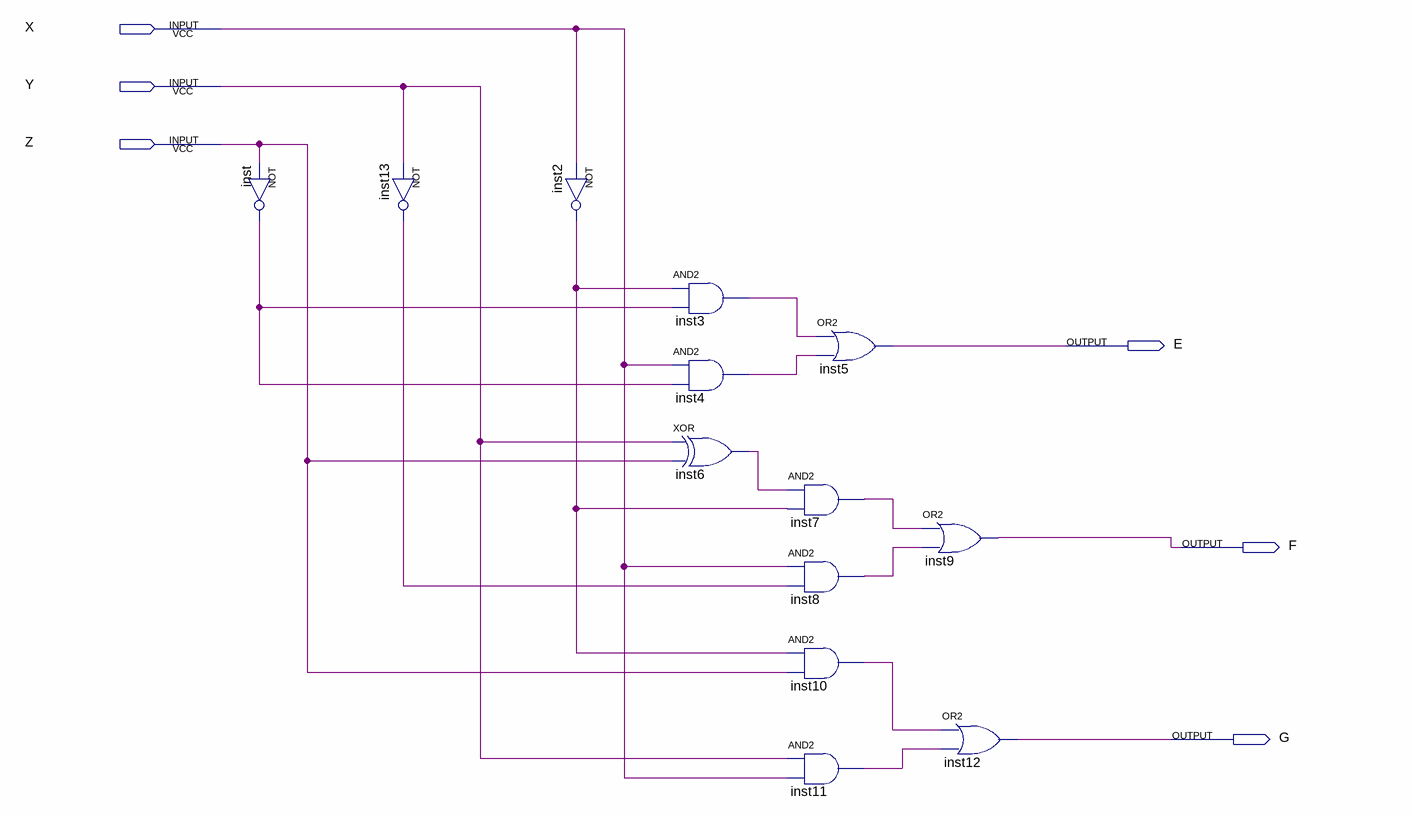
[diagram p0: schematic sheet]
// Quartus schematic lab2.bdf as structural Verilog: 13 symbols, 6 pins
module lab2 (
  input  X,
  input  Y,
  input  Z,
  output E,
  output F,
  output G
);

  wire inst2_out, inst3_out, inst4_out, inst6_out, inst7_out, inst8_out, inst10_out, inst11_out, inst13_out,
       inst_out;

  not inst (inst_out, Z);
  not inst13 (inst13_out, Y);
  not inst2 (inst2_out, X);
  and inst3 (inst3_out, inst2_out, inst_out);
  and inst4 (inst4_out, X, inst_out);
  xor inst6 (inst6_out, Y, Z);
  and inst7 (inst7_out, inst6_out, inst2_out);
  and inst8 (inst8_out, X, inst13_out);
  and inst10 (inst10_out, inst2_out, Z);
  and inst11 (inst11_out, Y, X);
  or inst5 (E, inst3_out, inst4_out);
  or inst9 (F, inst7_out, inst8_out);
  or inst12 (G, inst10_out, inst11_out);
endmodule
